# Altium schematic sheet vco-brd.SchDoc
size A
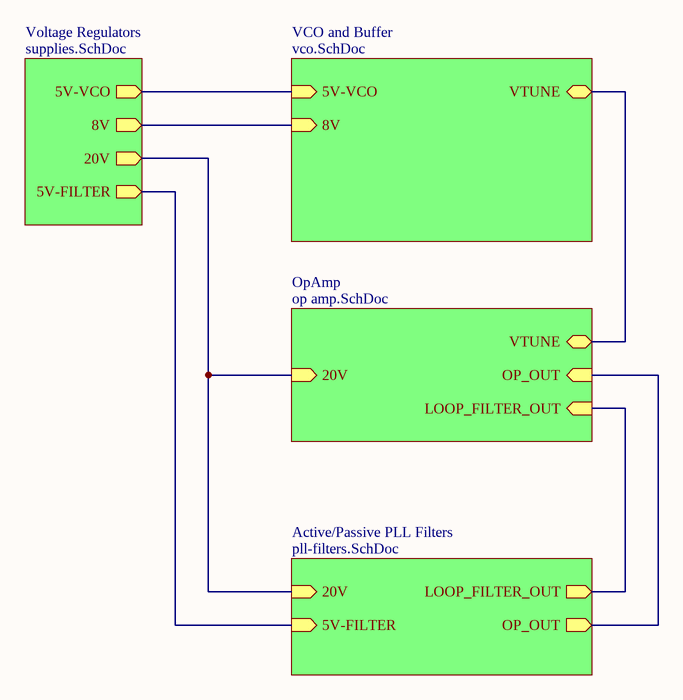
[diagram p0: vco-brd.SchDoc]

## Sub-sheets
Active/Passive PLL Filters = pll-filters.SchDoc: 5V-FILTER (in), 20V (in), LOOP_FILTER_OUT (out), OP_OUT (out)
OpAmp = op amp.SchDoc: 20V (in), VTUNE (bidir), LOOP_FILTER_OUT (in), OP_OUT (in)
VCO and Buffer = vco.SchDoc: 5V-VCO (in), 8V (in), VTUNE (bidir)
Voltage Regulators = supplies.SchDoc: 5V-VCO (out), 8V (out), 20V (out), 5V-FILTER (out)

## Nets
(unnamed): sheet Voltage Regulators/5V-VCO, sheet VCO and Buffer/5V-VCO
(unnamed): sheet Voltage Regulators/8V, sheet VCO and Buffer/8V
(unnamed): sheet Voltage Regulators/20V, sheet OpAmp/20V, sheet Active/Passive PLL Filters/20V
(unnamed): sheet Voltage Regulators/5V-FILTER, sheet Active/Passive PLL Filters/5V-FILTER
(unnamed): sheet VCO and Buffer/VTUNE, sheet OpAmp/VTUNE
(unnamed): sheet OpAmp/LOOP_FILTER_OUT, sheet Active/Passive PLL Filters/LOOP_FILTER_OUT
(unnamed): sheet OpAmp/OP_OUT, sheet Active/Passive PLL Filters/OP_OUT